# EAGLE design hymera (EAGLE 5.07)
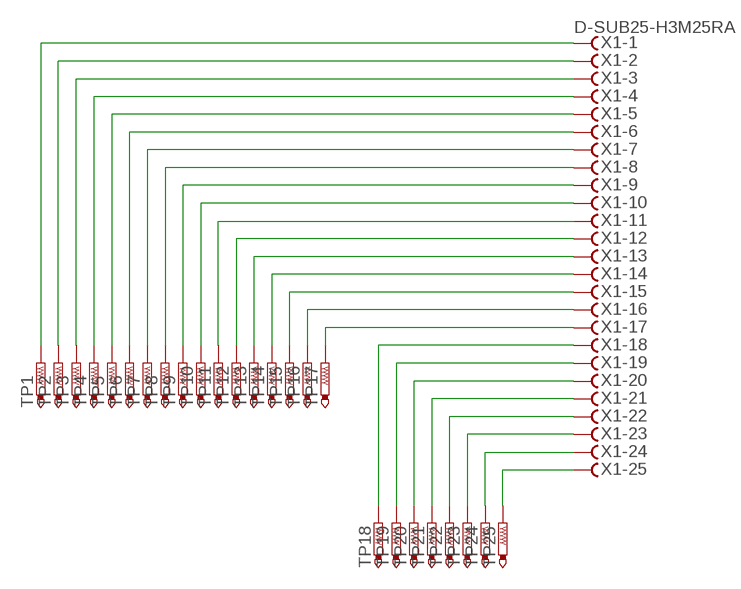
[diagram p0: schematic, sheet 1]

## Parts
TP1  PTR1PAD1-13  [P1-13]
TP2  PTR1PAD1-13  [P1-13]
TP3  PTR1PAD1-13  [P1-13]
TP4  PTR1PAD1-13  [P1-13]
TP5  PTR1PAD1-13  [P1-13]
TP6  PTR1PAD1-13  [P1-13]
TP7  PTR1PAD1-13  [P1-13]
TP8  PTR1PAD1-13  [P1-13]
TP9  PTR1PAD1-13  [P1-13]
TP10  PTR1PAD1-13  [P1-13]
TP11  PTR1PAD1-13  [P1-13]
TP12  PTR1PAD1-13  [P1-13]
TP13  PTR1PAD1-13  [P1-13]
TP14  PTR1PAD1-13  [P1-13]
TP15  PTR1PAD1-13  [P1-13]
TP16  PTR1PAD1-13  [P1-13]
TP17  PTR1PAD1-13  [P1-13]
TP18  PTR1PAD1-13  [P1-13]
TP19  PTR1PAD1-13  [P1-13]
TP20  PTR1PAD1-13  [P1-13]
TP21  PTR1PAD1-13  [P1-13]
TP22  PTR1PAD1-13  [P1-13]
TP23  PTR1PAD1-13  [P1-13]
TP24  PTR1PAD1-13  [P1-13]
TP25  PTR1PAD1-13  [P1-13]
X1  D-SUB25-H3M25RA  [H3M25RA]

## Nets
N$1: TP1.TP X1.1
N$2: TP2.TP X1.2
N$3: TP3.TP X1.3
N$4: TP4.TP X1.4
N$5: TP5.TP X1.5
N$6: TP6.TP X1.6
N$7: TP7.TP X1.7
N$8: TP8.TP X1.8
N$9: TP9.TP X1.9
N$10: TP10.TP X1.10
N$11: TP11.TP X1.11
N$12: TP12.TP X1.12
N$13: TP13.TP X1.13
N$14: TP14.TP X1.14
N$15: TP15.TP X1.15
N$16: TP16.TP X1.16
N$17: TP17.TP X1.17
N$18: TP18.TP X1.18
N$19: TP19.TP X1.19
N$20: TP20.TP X1.20
N$21: TP21.TP X1.21
N$22: TP22.TP X1.22
N$23: TP23.TP X1.23
N$24: TP24.TP X1.24
N$25: TP25.TP X1.25

## Library data of the parts
TP1-TP25 = matt testpad:PTR1: TEST PIN
X1 = con-thomas-betts:D-SUB25-: D-Subminiatur Connector Source: Electronioc Interconnects European Edition 1998

## Board
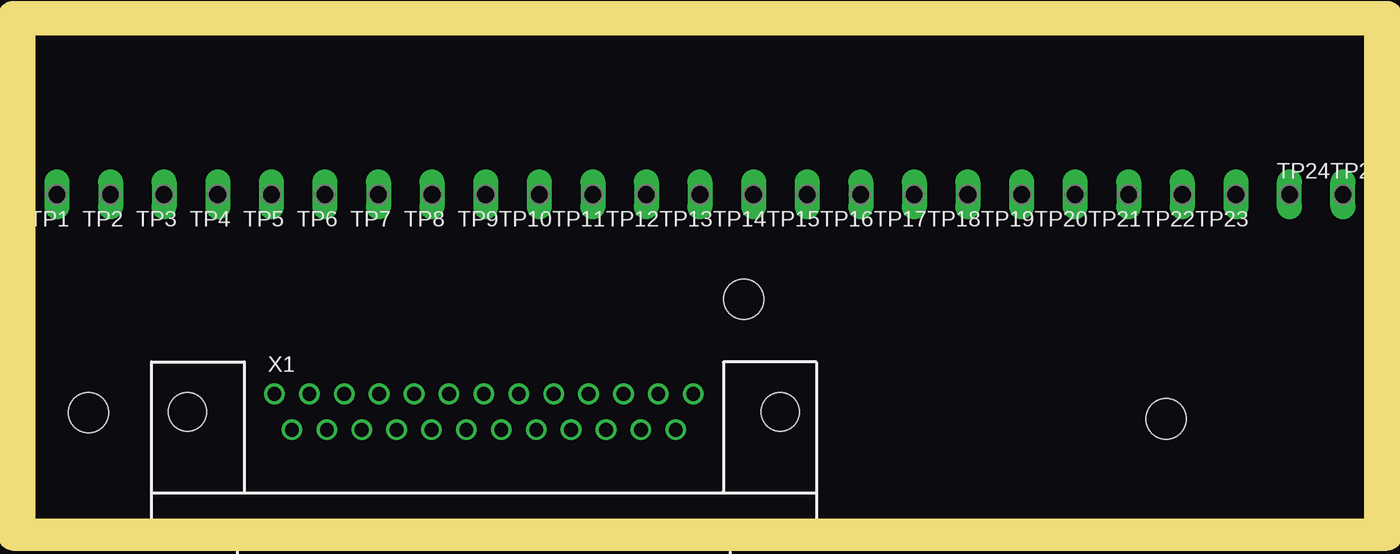
[diagram p1: board, top side]
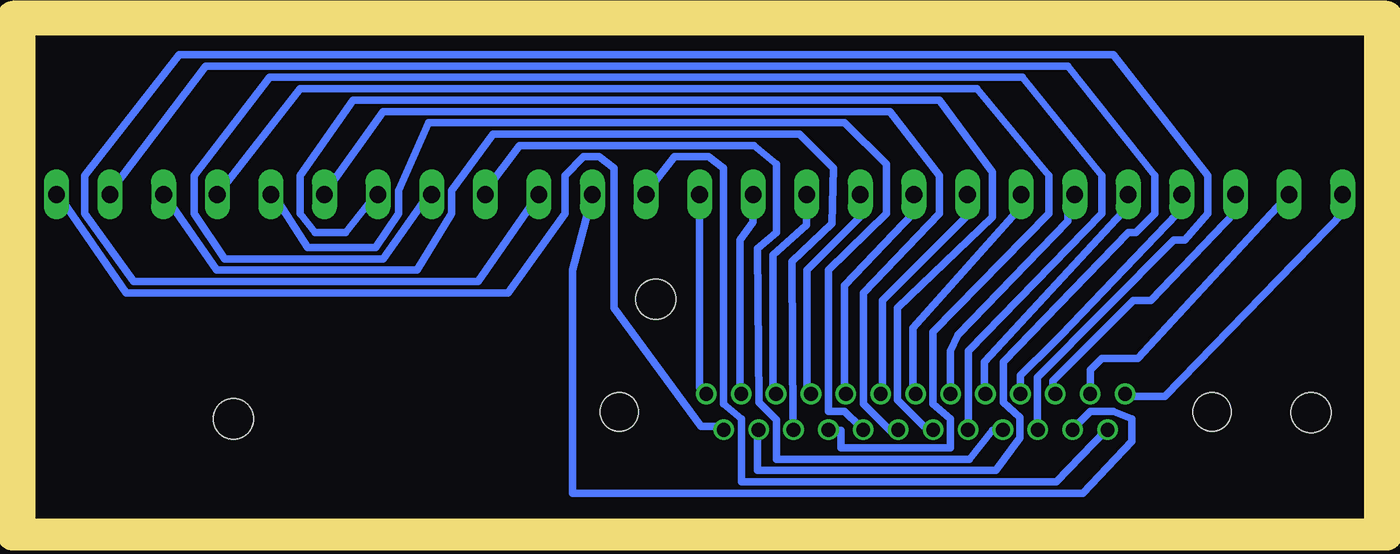
[diagram p2: board, bottom side, seen from below]

Size 106.01 x 38.94 mm. Coordinates in mm from the lower left corner, seen from the top.
Outline: 0,0 106.01,0 106.01,38.94 0,38.94 0,0
Copper layers (1*16): Top 0.035mm / dielectric 1.5mm / Bottom 0.035mm
Design rules "default *": minimum track width 0.3mm, minimum drill 24mil, track to track 8mil, track to pad 8mil, pad to pad 8mil, via to via 8mil, smd to smd 8mil, copper to edge 40mil, drill to drill 8mil, minimum pad ring 10mil, minimum via ring 8mil, stop-mask expansion 4mil, vias tented up to drill 0mil, thermal gap 10mil
Holes 3.2 mm at 4.51,8.7 90.01,8.2 56.51,17.7
Milling: 4 lines

### Footprints (pad centres in the part's own frame; a part is rotated, then mirrored left to right if it is on the bottom)
P1-13 = drill 1.321 pad 1.778 long: TP 0,0
H3M25RA = drill 1.092 round: 1 -16.612,1.422; 2 -13.843,1.422; 3 -11.074,1.422; 4 -8.306,1.422; 5 -5.537,1.422; 6 -2.769,1.422; 7 0,1.422; 8 2.769,1.422; 9 5.537,1.422; 10 8.306,1.422; 11 11.074,1.422; 12 13.843,1.422; 13 16.612,1.422; 14 -15.227,-1.422; 15 -12.459,-1.422; 16 -9.69,-1.422; 17 -6.921,-1.422; 18 -4.153,-1.422; 19 -1.384,-1.422; 20 1.384,-1.422; 21 4.153,-1.422; 22 6.921,-1.422; 23 9.69,-1.422; 24 12.459,-1.422; 25 15.227,-1.422 | hole 3.048: -23.52,0; 23.52,0

### Placement (x,y rotation side)
TP1  2.02,26 180 top
TP2  6.27,26 180 top
TP3  10.52,26 180 top
TP4  14.77,26 180 top
TP5  19.02,26 180 top
TP6  23.27,26 180 top
TP7  27.52,26 180 top
TP8  31.77,26 180 top
TP9  36.02,26 180 top
TP10  40.27,26 180 top
TP11  44.53,26 180 top
TP12  48.78,26 180 top
TP13  53.03,26 180 top
TP14  57.28,26 180 top
TP15  61.53,26 180 top
TP16  65.78,26 180 top
TP17  70.03,26 180 top
TP18  74.28,26 180 top
TP19  78.53,26 180 top
TP20  82.79,26 180 top
TP21  87.04,26 180 top
TP22  91.29,26 180 top
TP23  95.54,26 180 top
TP24  99.79,26 0 top
TP25  104.04,26 0 top
X1  35.88,8.75 0 top

### Tracks (layer width: path | path; a pad name or v marks a point on that pad's centre or on a via)
N$1
  Bottom 0.61: TP1.TP 1.92,24.6 16.11,10 19.1,10 X1.1
N$2
  Bottom 0.61: X1.2 22.04,12.07 21.11,13 18.27,13 TP2.TP
N$3
  Bottom 0.61: TP3.TP 10.52,24.6 17.21,17.6 18.61,17.6 25.01,11.2 25.01,10.38 X1.3
N$4
  Bottom 0.61: X1.4 27.58,11.64 25.01,14.2 24.37,14.8 15.11,24.5 15.11,26 TP4.TP
N$5
  Bottom 0.61: TP5.TP 19.02,25.09 30.41,12.7 30.41,10.24 X1.5
N$6
  Bottom 0.61: X1.6 33.11,13.6 32.51,14.86 23.81,23.9 23.81,26 TP6.TP
N$7
  Bottom 0.61: TP7.TP 27.52,24.99 36.11,15.4 36.11,10.41 X1.7
N$8
  Bottom 0.61: TP8.TP 31.77,24.34 38.51,17.6 38.51,10.32 X1.8
N$9
  Bottom 0.61: TP9.TP 36.02,24.59 41.51,18.8 41.51,10.57 X1.9
N$10
  Bottom 0.61: TP10.TP 40.27,24.24 44.51,20 44.51,10.5 X1.10
N$11
  Bottom 0.61: TP11.TP 44.53,23.59 47.21,21.2 47.21,10.43 X1.11
N$12
  Bottom 0.61: TP12.TP 48.78,23.84 49.81,22.4 49.81,10.3 49.61,9.7 49.61,10.06 X1.12
N$13
  Bottom 0.61: TP13.TP 53.03,10.71 X1.13
N$14
  Bottom 0.61: X1.14 20.81,7.3 24.71,3.2 49.71,3.2 49.71,8.2 51.11,9.4 51.11,28.1 52.31,29 55.01,29 57.11,26.3 TP14.TP
N$15
  Bottom 0.61: X1.15 23.21,7.6 22.01,8.8 20.21,8.8 18.71,8.2 18.71,6.4 22.61,2.3 63.11,2.3 63.11,20 TP15.TP
N$16
  Bottom 0.61: X1.16 26.21,7.6 26.21,11.5 15.41,22.4 14.51,22.4 12.71,24.5 12.71,27.5 20.21,37.1 94.31,37.1 101.81,27.5 101.81,24.5 97.91,19.1 70.61,19.1 65.81,26 TP16.TP
N$17
  Bottom 0.61: X1.17 29.21,7.3 29.81,7.3 31.61,5 46.91,5 46.91,8.1 48.31,9.5 48.41,21.7 46.91,23 46.91,28.4 48.71,29.9 67.31,29.9 70.01,26.3 TP17.TP
N$18
  Bottom 0.61: X1.18 31.71,7.6 31.71,13.6 21.11,24.5 21.11,27.5 27.41,35.3 87.11,35.3 93.11,27.5 93.11,24.5 90.71,20.9 78.11,20.9 74.51,26 TP18.TP
N$19
  Bottom 0.61: X1.19 34.61,7.6 35.21,7.6 37.31,9.7 37.31,17 29.81,24.2 29.81,27.8 34.01,33.5 80.51,33.5 84.71,27.5 84.71,24.5 83.51,23 81.11,23 78.71,26 TP19.TP
N$20
  Bottom 0.61: X1.20 37.31,7.6 37.91,7.3 40.01,9.4 40.01,18.2 34.01,24.5 34.01,27.5 37.91,32.6 78.11,32.6 82.61,26.3 TP20.TP
N$21
  Bottom 0.61: X1.21 40.31,7.6 41.51,8.8 42.81,8.8 42.81,20 38.21,24.5 38.21,28.4 41.51,31.7 74.51,31.7 76.91,26.3 76.91,24.5 78.71,21.8 84.11,21.8 86.81,26 TP21.TP
N$22
  Bottom 0.61: X1.22 42.71,7.3 41.81,7.3 41.81,5.9 33.11,5.9 33.11,8.2 34.51,9.4 34.51,15.1 25.31,24.5 25.31,27.5 31.01,34.4 84.71,34.4 91.01,26.3 TP22.TP
N$23
  Bottom 0.61: X1.23 45.61,7.6 45.71,20.7 42.51,23.7 42.41,28.1 45.11,30.8 69.41,30.8 72.71,26.3 72.71,24.5 75.41,20 91.31,20 95.51,26 TP23.TP
N$24
  Bottom 0.61: X1.24 48.41,7.3 48.41,4.1 29.51,4.1 27.61,6.7 27.61,8.3 28.91,9.5 28.91,12.7 19.01,23 18.41,23 16.91,24.5 16.91,27.5 23.81,36.2 92.21,36.2 99.71,26.3 TP24.TP
N$25
  Bottom 0.61: X1.25 51.11,7.6 52.91,7.6 59.81,17 59.81,28.1 61.01,29 62.21,29 63.71,27.5 63.71,24.5 68.21,18.2 98.51,18.2 103.91,26 TP25.TP